# EAGLE design LEDMotherboard (EAGLE 6.4)
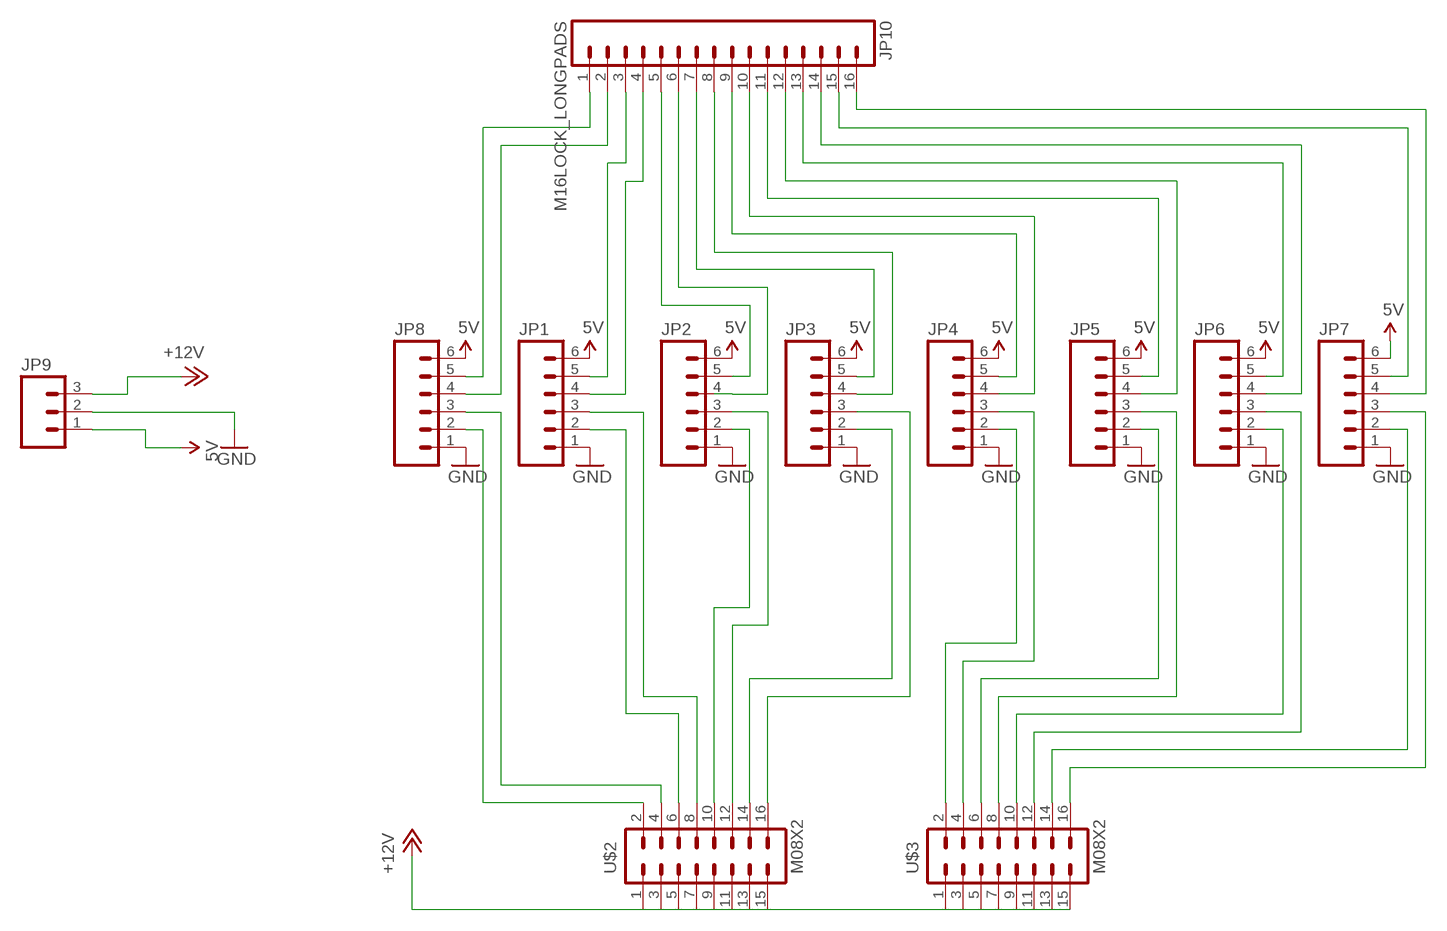
[diagram p0: schematic, sheet 1]

## Parts
JP1  M06LOCK_LONGPADS  [1X06_LOCK_LONGPADS]
JP2  M06LOCK_LONGPADS  [1X06_LOCK_LONGPADS]
JP3  M06LOCK_LONGPADS  [1X06_LOCK_LONGPADS]
JP4  M06LOCK_LONGPADS  [1X06_LOCK_LONGPADS]
JP5  M06LOCK_LONGPADS  [1X06_LOCK_LONGPADS]
JP6  M06LOCK_LONGPADS  [1X06_LOCK_LONGPADS]
JP7  M06LOCK_LONGPADS  [1X06_LOCK_LONGPADS]
JP8  M06LOCK_LONGPADS  [1X06_LOCK_LONGPADS]
JP9  M03-SCREW-5MM  [SCREWTERMINAL-5MM-3]
JP10  M16LOCK_LONGPADS  [1X16_LOCK_LONGPADS]
U$2  M08X2  [2X8]
U$3  M08X2  [2X8]

## Nets
5V: JP1.6 JP2.6 JP3.6 JP4.6 JP5.6 JP6.6 JP7.6 JP8.6 JP9.1
+12V: JP9.3 U$2.1 U$2.3 U$2.5 U$2.7 U$2.9 U$2.11 U$2.13 U$2.15 U$3.1 U$3.3 U$3.5 U$3.7 U$3.9 U$3.11 U$3.13 U$3.15
GND: JP1.1 JP2.1 JP3.1 JP4.1 JP5.1 JP6.1 JP7.1 JP8.1 JP9.2
N$1: JP8.4 JP10.2
N$2: JP8.3 U$2.4
N$3: JP8.5 JP10.1
N$4: JP5.4 JP10.12
N$5: JP1.5 JP10.3
N$6: JP1.4 JP10.4
N$7: JP1.2 U$2.6
N$8: JP1.3 U$2.8
N$10: JP3.5 JP10.7
N$12: JP3.4 JP10.8
N$13: JP4.5 JP10.9
N$14: JP4.4 JP10.10
N$15: JP5.5 JP10.11
N$16: JP6.5 JP10.13
N$17: JP6.4 JP10.14
N$18: JP7.5 JP10.15
N$19: JP7.4 JP10.16
N$20: JP2.2 U$2.10
N$21: JP2.3 U$2.12
N$22: JP3.3 U$2.16
N$23: JP3.2 U$2.14
N$24: JP4.2 U$3.2
N$25: JP8.2 U$2.2
N$26: JP2.4 JP10.6
N$27: JP4.3 U$3.4
N$28: JP5.2 U$3.6
N$29: JP5.3 U$3.8
N$30: JP6.2 U$3.10
N$31: JP6.3 U$3.12
N$32: JP7.2 U$3.14
N$33: JP7.3 U$3.16
N$34: JP2.5 JP10.5

## Library data of the parts
JP1-JP8 = SparkFun-Connectors:M06: Header 6 Standard 6-pin 0.1" header. Use with straight break away headers (SKU : PRT-00116), right angle break away headers (PRT-00553), swiss pins (PRT-00743), machine pins (PRT-00117), and female headers (PRT-00115). Molex polarized connector foot print use with SKU : PRT-08094 with associated crimp pins and housings. NOTES ON THE VARIANTS LOCK and LOCK_LONGPADS... This footprint was designed to help hold the alignment of a through-hole component (i.e. 6-pin header) while soldering it into place. You may notice that each hole has been shifted either up or down by 0.005 of an inch from it's more standard position (which is a perfectly straight line). This slight alteration caused the pins (the squares in the middle) to touch the edges of the holes. Because they are alternating, it causes a "brace" to hold the component in place. 0.005 has proven to be the perfect amount of "off-center" position when using our standard breakaway headers. Although looks a little odd when you look at the bare footprint, once you have a header in there, the alteration is very hard to notice. Also,if you push a header all the way into place, it is covered up entirely on the bottom side. This idea of altering the position of holes to aid alignment will be further integrated into the Sparkfun Library for other footprints. It can help hold any component with 3 or more connection pins.
JP9 = SparkFun-Connectors:M03: Header 3 Standard 3-pin 0.1" header. Use with straight break away headers (SKU : PRT-00116), right angle break away headers (PRT-00553), swiss pins (PRT-00743), machine pins (PRT-00117), and female headers (PRT-00115). Molex polarized connector foot print use with SKU : PRT-08232 with associated crimp pins and housings.
JP10 = SparkFun-Connectors:M16: 1x16 .1" header
U$2 U$3 = SparkFun-Connectors:M08X2: .1" headers, two rows of 8 each

## Board
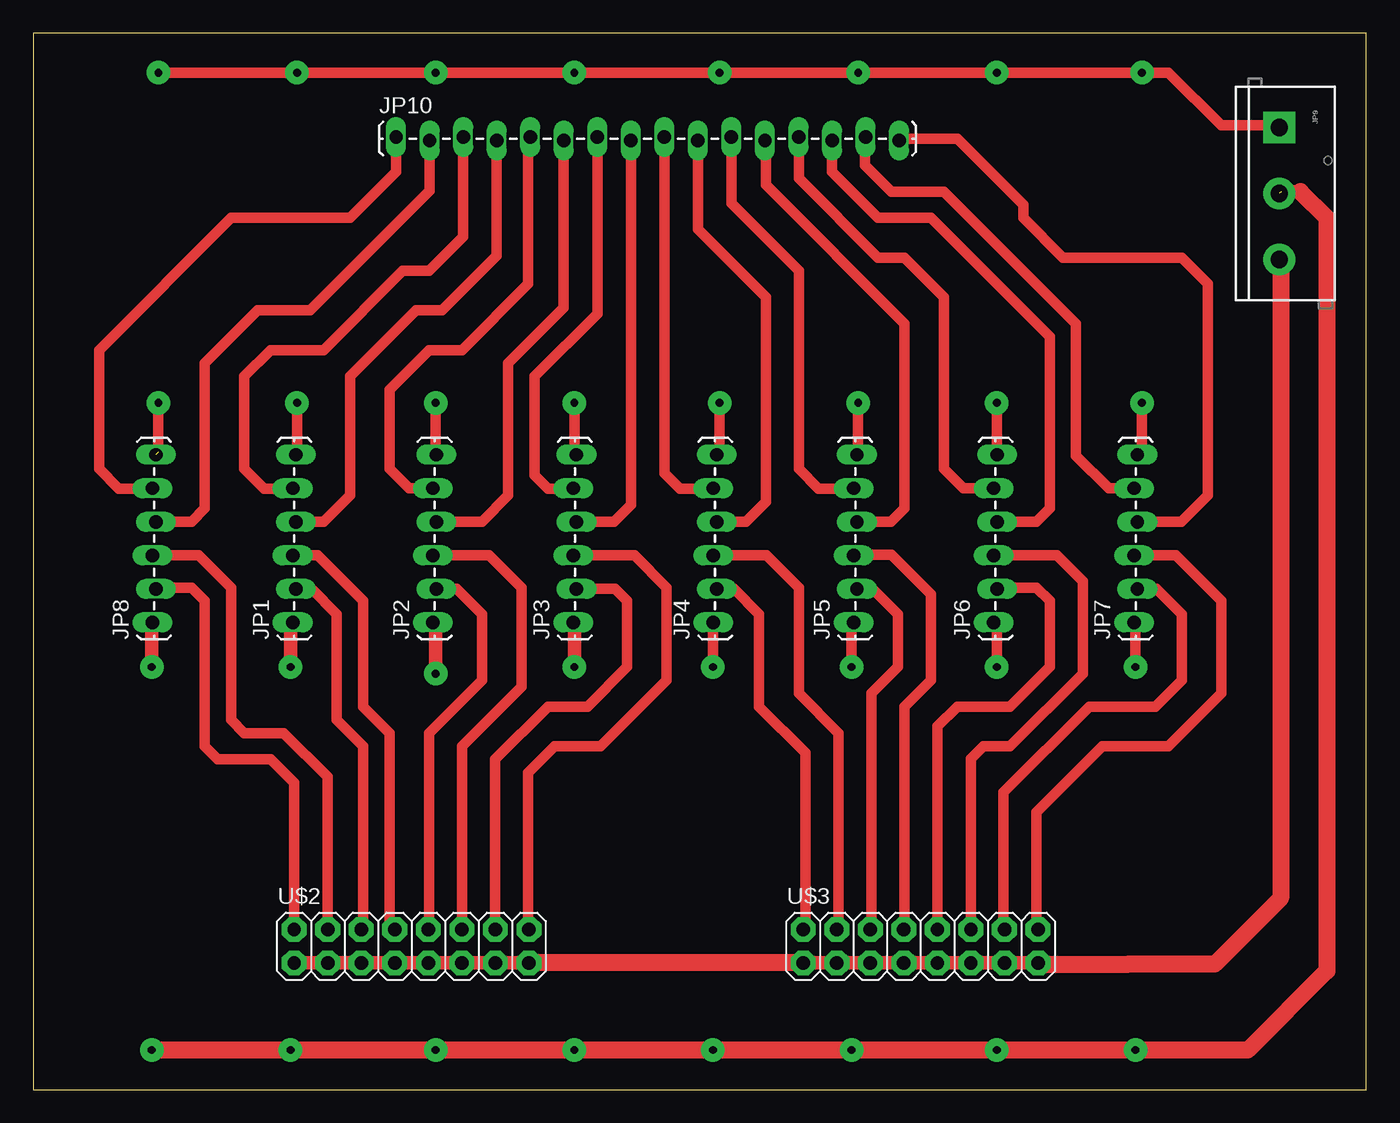
[diagram p1: board, top side]
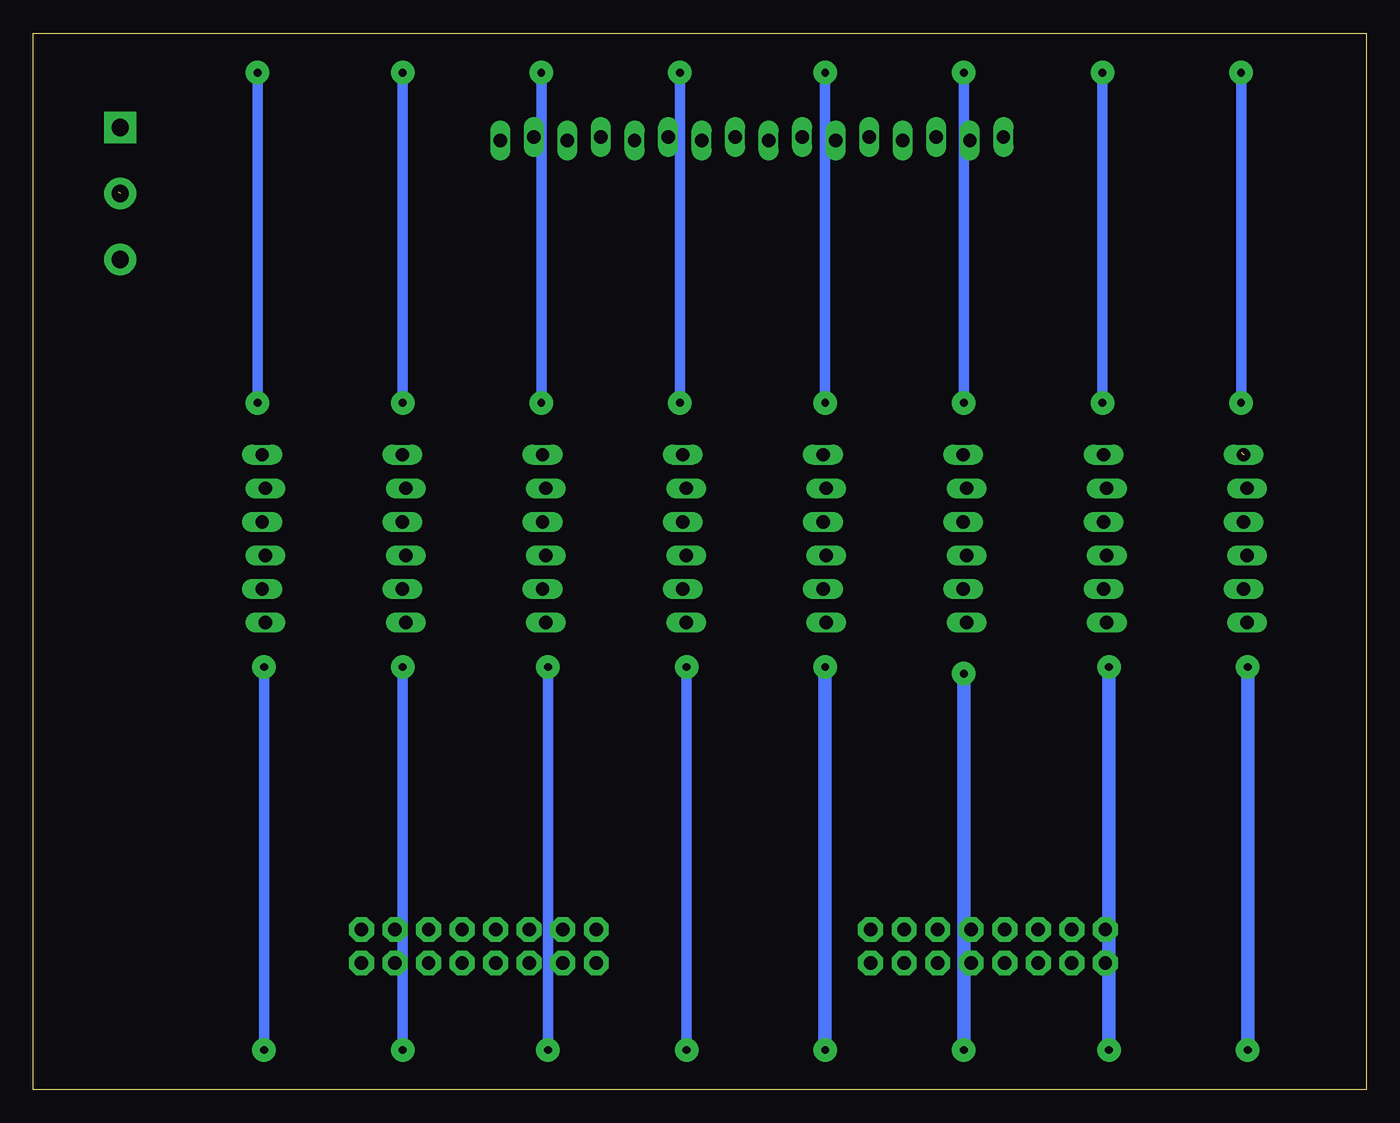
[diagram p2: board, bottom side, seen from below]

Size 101 x 80 mm. Coordinates in mm from the lower left corner, seen from the top.
Outline: 0,0 101,0 101,80 0,80 0,0
Copper layers (1*16): Top 0.035mm / dielectric 1.5mm / Bottom 0.035mm
Design rules "default": minimum track width 10mil, minimum drill 24mil, track to track 8mil, track to pad 8mil, pad to pad 8mil, via to via 8mil, smd to smd 8mil, copper to edge 40mil, drill to drill 8mil, minimum pad ring 10mil, minimum via ring 8mil, stop-mask expansion 4mil, vias tented up to drill 0mil, thermal gap 10mil

### Footprints (pad centres in the part's own frame; a part is rotated, then mirrored left to right if it is on the bottom)
1X06_LOCK_LONGPADS = drill 1.016 long: 1 0,0; 2 2.54,-0.254; 3 5.08,0; 4 7.62,-0.254; 5 10.16,0; 6 12.7,-0.254
SCREWTERMINAL-5MM-3 = drill 1.3 pad 2.413 square: 1 0,0 | drill 1.3 pad 2.413: 2 5,0; 3 10,0
1X16_LOCK_LONGPADS = drill 1.016 long: 1 0,0.127; 2 2.54,-0.127; 3 5.08,0.127; 4 7.62,-0.127; 5 10.16,0.127; 6 12.7,-0.127; 7 15.24,0.127; 8 17.78,-0.127; 9 20.32,0.127; 10 22.86,-0.127; 11 25.4,0.127; 12 27.94,-0.127; 13 30.48,0.127; 14 33.02,-0.127; 15 35.56,0.127; 16 38.1,-0.127
2X8 = drill 1.016 pad 1.88 octagon: 1 0,0; 2 0,2.54; 3 2.54,0; 4 2.54,2.54; 5 5.08,0; 6 5.08,2.54; 7 7.62,0; 8 7.62,2.54; 9 10.16,0; 10 10.16,2.54; 11 12.7,0; 12 12.7,2.54; 13 15.24,0; 14 15.24,2.54; 15 17.78,0; 16 17.78,2.54

### Placement (x,y rotation side)
JP1  19.67,35.37 90 top
JP2  30.29,35.37 90 top
JP3  40.91,35.37 90 top
JP4  51.53,35.37 90 top
JP5  62.15,35.37 90 top
JP6  72.77,35.37 90 top
JP7  83.39,35.37 90 top
JP8  9.05,35.37 90 top
JP9  94.39,72.85 270 top
JP10  27.5,72 0 top
U$2  19.78,9.59 0 top
U$3  58.34,9.59 0 top

### Tracks (layer width: path | path; a pad name or v marks a point on that pad's centre or on a via)
5V  (via drill 0.6 pad 1.78)  (1 unrouted)
  Top 0.813: 9.5,48.27 v9.5,52 | JP2.6 30.5,48.11 v30.5,52 | JP4.6 52,48.29 v52,52 | JP6.6 73,48.09 v73,52 | JP7.6 83.5,48.21 84,48.71 v84,52 | JP9.1 94.24,73 90,73 86,77 v84,77 v73,77 v62.5,77 v52,77 v41,77 v30.5,77 v20,77 v9.5,77 | JP1.6 20,48.15 v20,52 | JP3.6 41,48.23 v41,52 | JP5.6 62.5,48.17 v62.5,52
  Bottom 0.813: v9.5,52 v9.5,77 | v20,52 v20,77 | v30.5,52 v30.5,77 | v41,52 v41,77 | v52,52 v52,77 | v62.5,52 v62.5,77 | v73,52 v73,77 | v84,52 v84,77
+12V
  Top 0.813: U$3.15 76.21,9.5
  Top 1.016: U$3.1 U$3.3 U$3.5 U$3.7 U$3.9 U$3.11 U$3.13 U$3.15 | U$2.1 U$2.3 U$2.5 U$2.7 U$2.9 U$2.11 U$2.13 U$2.15 | JP9.3 94.5,62.74
  Top 1.27: U$3.1 U$2.15 | 94.5,62.74 94.5,14.5 89.5,9.5 83,9.5 76.21,9.5
GND  (via drill 0.6, 0.6 pad 1.02, 0.6 pad 1.27, 0.6 pad 1.78)  (1 unrouted)
  Top 0.813: JP4.1 51.5,35.34 v51.5,32 | JP5.1 62,35.22 v62,32 | JP6.1 73,35.14 v73,32 | JP7.1 83.5,35.26 v83.5,32
  Top 1.016: JP8.1 9,35.32 v9,32 | JP1.1 19.5,35.2 v19.5,32 | JP2.1 30.5,35.16 v30.5,31.5 | JP3.1 41,35.28 v41,32 | 94.54,68 96,68
  Top 1.27: v9,3 v19.5,3 v30.5,3 v41,3 v51.5,3 v62,3 v73,3 v83.5,3 92,3 98,9 98,66 96,68
  Bottom 0.813: v51.5,32 v51.5,3 | v62,32 v62,3 | v73,32 v73,3 | v83.5,32 v83.5,3
  Bottom 1.016: v9,32 v9,3 | v19.5,32 v19.5,3 | v30.5,31.5 v30.5,3 | v41,32 v41,3
N$1
  Top 0.813: JP8.4 9.31,43 12,43 13,44 13,55 17,59 21,59 30.04,68.04 JP10.2
N$2
  Top 0.813: U$2.4 22.32,23.68 19,27 16,27 15,28 15,38 12.55,40.45 JP8.3
N$3
  Top 0.813: JP8.5 9.02,45.5 6.5,45.5 5,47 5,56 15,66 24,66 27.5,69.5 JP10.1
N$4
  Top 0.813: JP10.12 55.5,71.81 55.5,68.5 66,58 66,44 64.99,42.99 JP5.4
N$5
  Top 0.813: JP1.5 19.64,45.5 17.5,45.5 16,47 16,54 18,56 22,56 28,62 30,62 32.58,64.58 JP10.3
N$6
  Top 0.813: JP1.4 19.93,43 22,43 24,45 24,54 29,59 31,59 35.12,63.12 JP10.4
N$7
  Top 0.813: U$2.6 25,12.27 25,26 23,28 23,36 21.09,37.91 JP1.2
N$8
  Top 0.813: U$2.8 27,12.53 27,27 25,29 25,37 21.55,40.45 JP1.3
N$10
  Top 0.813: JP3.5 40.88,45.5 39,45.5 38,46.5 38,54 42.74,58.74 JP10.7
N$12
  Top 0.813: JP3.4 41.17,43 44,43 45.28,44.28 JP10.8
N$13
  Top 0.813: JP4.5 51.5,45.5 49,45.5 47.82,46.68 JP10.9
N$14
  Top 0.813: JP4.4 51.79,43 54,43 55.5,44.5 55.5,60 50.36,65.14 JP10.10
N$15
  Top 0.813: JP5.5 62.12,45.5 59.5,45.5 58,47 58,62 52.9,67.1 JP10.11
N$16
  Top 0.813: JP10.13 58,72.11 58,69 64,63 66,63 69,60 69,47 70.47,45.53 JP6.5
N$17
  Top 0.813: JP6.4 73.03,43 76,43 77,44 77,57 68,66 64,66 60.52,69.48 JP10.14
N$18
  Top 0.813: JP10.15 63,72.07 63,70 65,68 69,68 79,58 79,48 81.47,45.53 JP7.5
N$19
  Top 0.813: JP10.16 65.73,72 70,72 75,67 75,66 78,63 87,63 89,61 89,45 86.99,42.99 JP7.4
N$20
  Top 0.813: U$2.10 30,12.19 30,27 34,31 34,36 32.09,37.91 JP2.2
N$21
  Top 0.813: U$2.12 32.5,12.15 32.5,26 37,30.5 37,38 34.55,40.45 JP2.3
N$22
  Top 0.813: U$2.16 37.5,12.19 37.5,24 39.5,26 43,26 48,31 48,38 45.55,40.45 JP3.3
N$23
  Top 0.813: U$2.14 35,12.15 35,25 39,29 42,29 45,32 45,37 44.09,37.91 JP3.2
N$24
  Top 0.813: U$3.2 58.5,12.29 58.5,25.5 55,29 55,36 53.09,37.91 JP4.2
N$25
  Top 0.813: U$2.2 19.78,23.22 18,25 14,25 13,26 13,37 12,38 9.39,38 JP8.2
N$26
  Top 0.813: JP2.4 30.55,43 34,43 36,45 36,55 40.2,59.2 JP10.6
N$27
  Top 0.813: U$3.4 61,12.25 61,27 58,30 58,38 55.55,40.45 JP4.3
N$28
  Top 0.813: U$3.6 63.5,12.21 63.5,30 65.5,32 65.5,36 63.59,37.91 JP5.2
N$29
  Top 0.813: U$3.8 66,12.17 66,29 68,31 68,37.5 65,40.5 62.2,40.5 JP5.3
N$30
  Top 0.813: U$3.10 68.5,27.5 70,29 74,29 77,32 77,37 76,38 73.11,38 JP6.2
N$31
  Top 0.813: 71,12.17 U$3.12 71.04,24 71.04,24.04 71.04,25.04 72,26 74,26 79.5,31.5 79.5,38.5 77.55,40.45 JP6.3
N$32
  Top 0.813: U$3.14 73.5,12.21 73.5,22.5 80,29 85,29 87,31 87,36 85.09,37.91 JP7.2
N$33
  Top 0.813: U$3.16 76,12.25 76,21 81,26 86,26 90,30 90,37 86.55,40.45 JP7.3
N$34
  Top 0.813: JP10.5 37.5,71.97 37.5,61 32.5,56 30,56 27,53 27,47 28.47,45.53 JP2.5